# Altium schematic sheet S7CAS-PLEIADES-CARTE-MERE_Pxx_DDR.SchDoc
size Tabloid; SheetNumber: 4; SheetTotal: 17; Sheet_Name: DDR; Size: 11x17
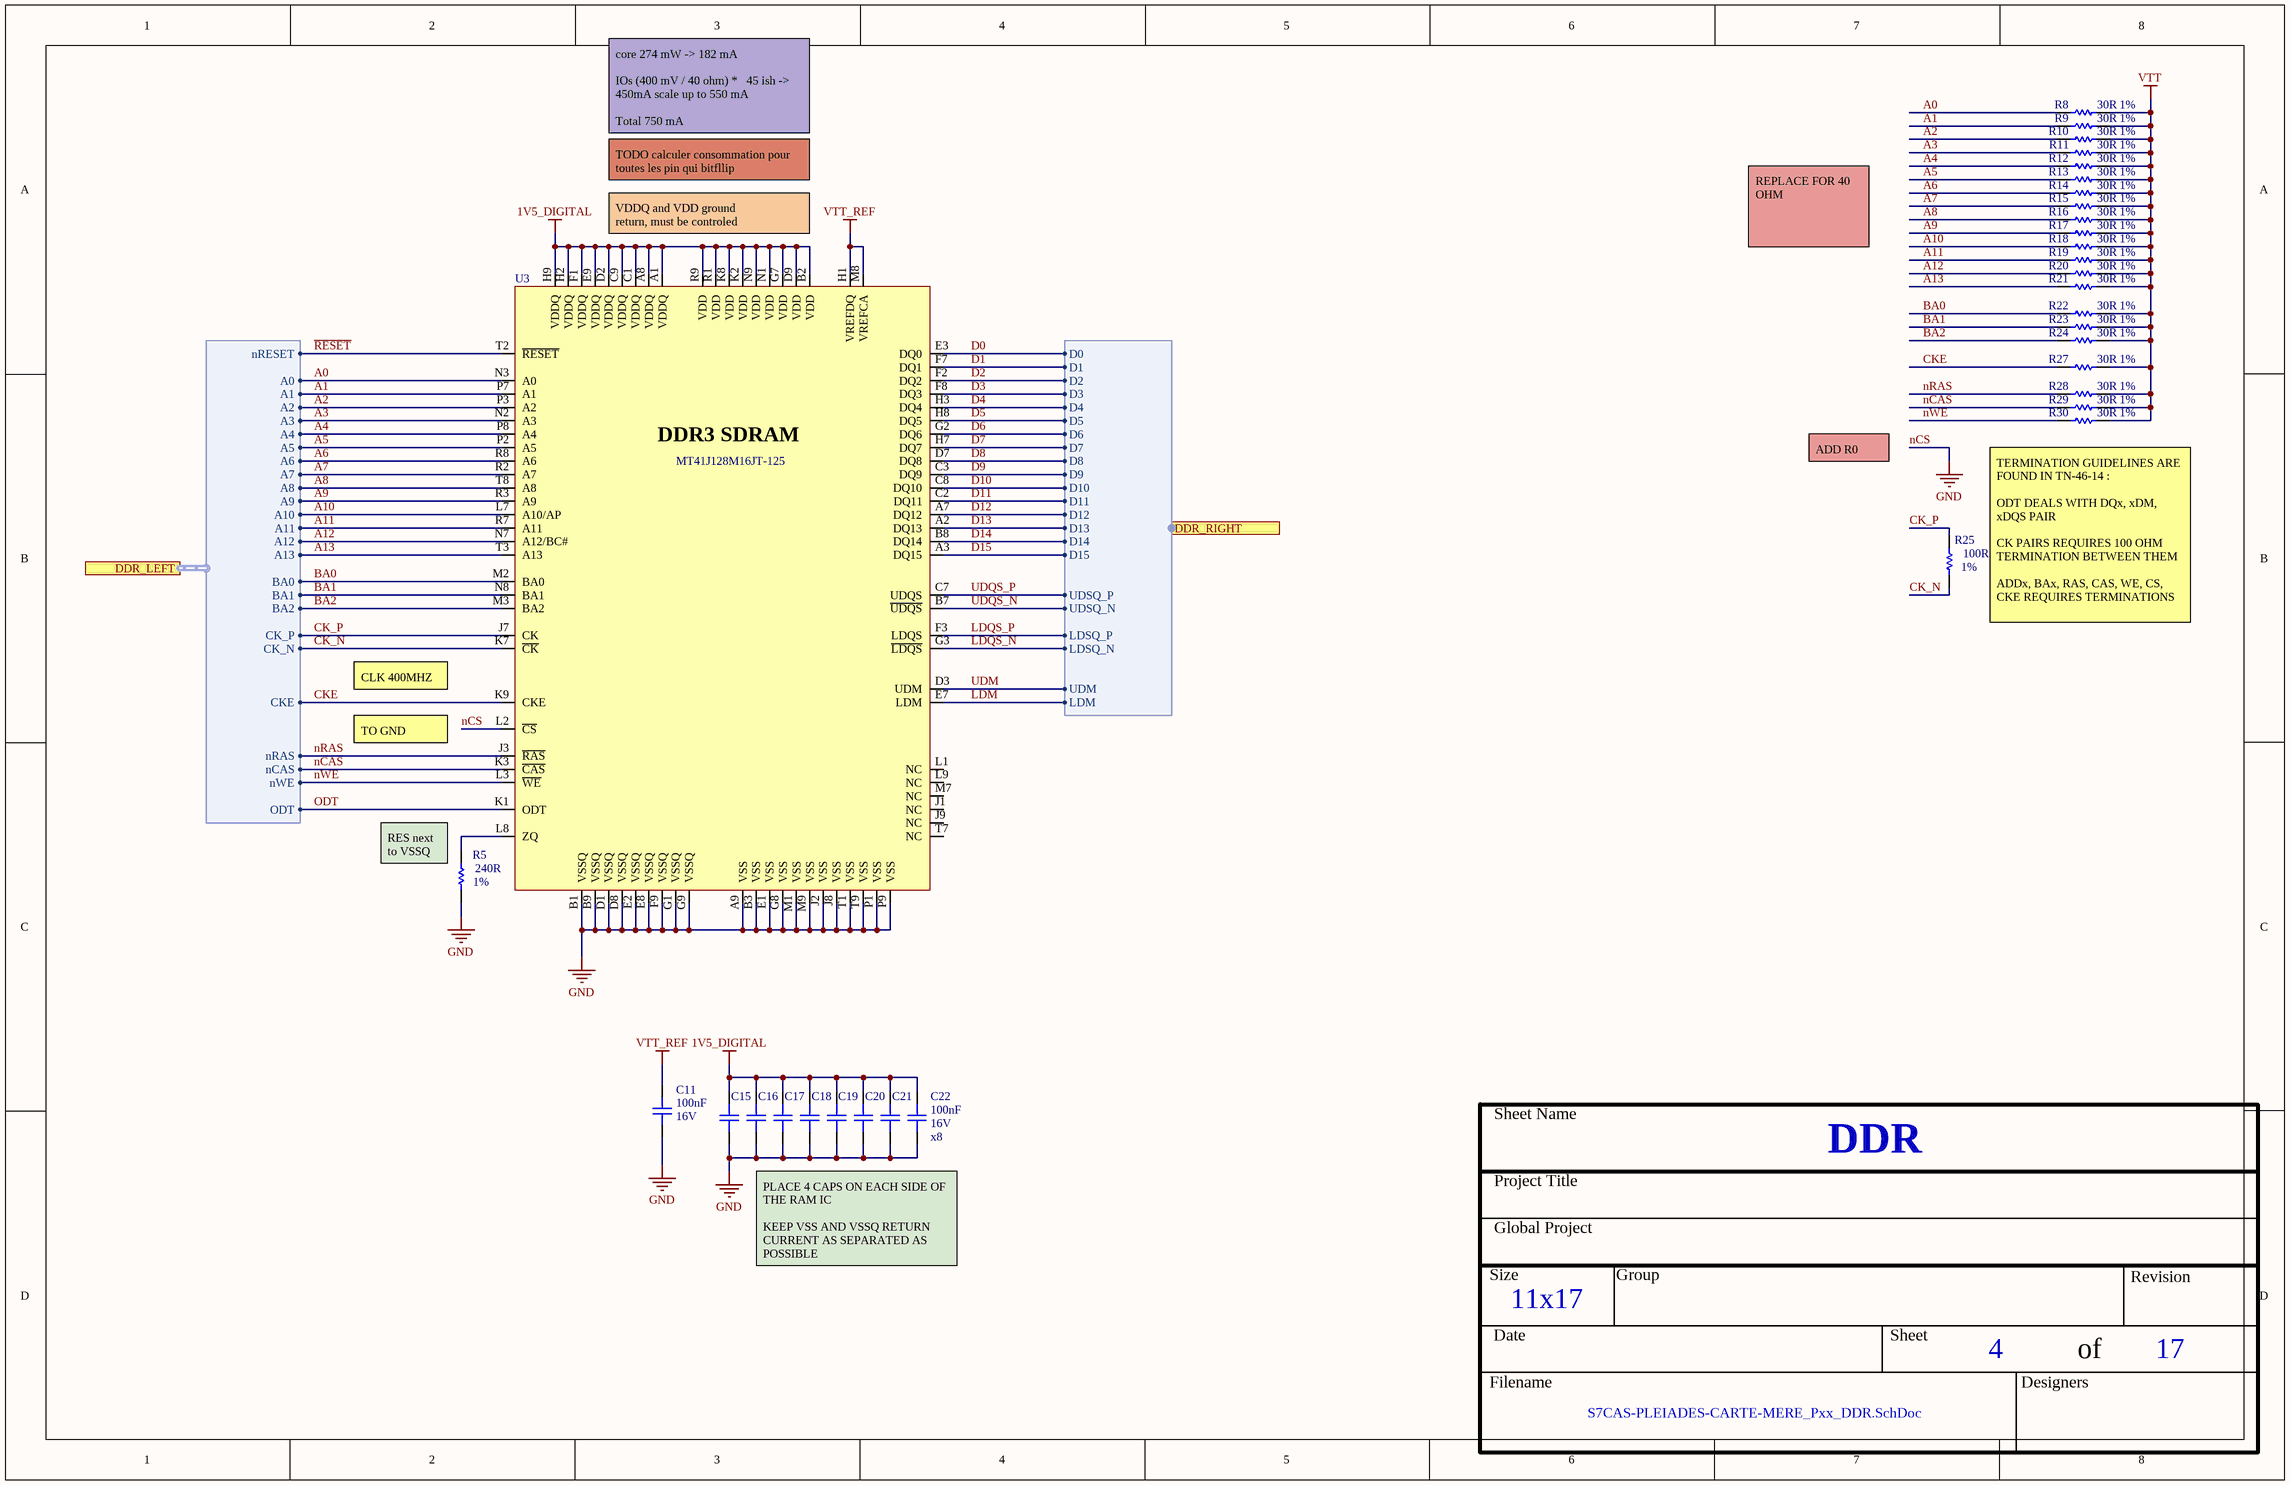
[diagram p0: S7CAS-PLEIADES-CARTE-MERE_Pxx_DDR.SchDoc]

## Parts
C11  value 100nF  Voltage: 16V  [CAP_0603]  (hidden comment: CAP - 0603)
C15  CAP - 0603  [CAP_0603]  (value not drawn)
C16  CAP - 0603  [CAP_0603]  (value not drawn)
C17  CAP - 0603  [CAP_0603]  (value not drawn)
C18  CAP - 0603  [CAP_0603]  (value not drawn)
C19  CAP - 0603  [CAP_0603]  (value not drawn)
C20  CAP - 0603  [CAP_0603]  (value not drawn)
C21  CAP - 0603  [CAP_0603]  (value not drawn)
C22  value 100nF  Voltage: 16V  [CAP_0603]  (hidden comment: CAP - 0603)
R5  value 240R  Precision: 1%  [RES_0603]  (hidden comment: RES - 0603)
R8  value 30R  Precision: 1%  [RES_0603]  (hidden comment: RES - 0603)
R9  value 30R  Precision: 1%  [RES_0603]  (hidden comment: RES - 0603)
R10  value 30R  Precision: 1%  [RES_0603]  (hidden comment: RES - 0603)
R11  value 30R  Precision: 1%  [RES_0603]  (hidden comment: RES - 0603)
R12  value 30R  Precision: 1%  [RES_0603]  (hidden comment: RES - 0603)
R13  value 30R  Precision: 1%  [RES_0603]  (hidden comment: RES - 0603)
R14  value 30R  Precision: 1%  [RES_0603]  (hidden comment: RES - 0603)
R15  value 30R  Precision: 1%  [RES_0603]  (hidden comment: RES - 0603)
R16  value 30R  Precision: 1%  [RES_0603]  (hidden comment: RES - 0603)
R17  value 30R  Precision: 1%  [RES_0603]  (hidden comment: RES - 0603)
R18  value 30R  Precision: 1%  [RES_0603]  (hidden comment: RES - 0603)
R19  value 30R  Precision: 1%  [RES_0603]  (hidden comment: RES - 0603)
R20  value 30R  Precision: 1%  [RES_0603]  (hidden comment: RES - 0603)
R21  value 30R  Precision: 1%  [RES_0603]  (hidden comment: RES - 0603)
R22  value 30R  Precision: 1%  [RES_0603]  (hidden comment: RES - 0603)
R23  value 30R  Precision: 1%  [RES_0603]  (hidden comment: RES - 0603)
R24  value 30R  Precision: 1%  [RES_0603]  (hidden comment: RES - 0603)
R25  value 100R  Precision: 1%  [RES_0603]  (hidden comment: RES - 0603)
R27  value 30R  Precision: 1%  [RES_0603]  (hidden comment: RES - 0603)
R28  value 30R  Precision: 1%  [RES_0603]  (hidden comment: RES - 0603)
R29  value 30R  Precision: 1%  [RES_0603]  (hidden comment: RES - 0603)
R30  value 30R  Precision: 1%  [RES_0603]  (hidden comment: RES - 0603)
U3  MT41J128M16JT-125  [MEM_DDR3_MT41J128M16JT-125]

## Ports
DDR_LEFT (harness ddr_left, see S7CAS-PLEIADES-CARTE-MERE_Pxx_FPGA_bank0_1_5[1C]), DDR_RIGHT (harness ddr_right, see S7CAS-PLEIADES-CARTE-MERE_Pxx_FPGA_bank0_1_5[3C])

## Harnesses
ddr_left: ODT, nRAS, nCAS, nWE, CKE, CK_P, CK_N, BA0, BA1, BA2, A0, A1, A2, A3, A4, A5, A6, A7, A8, A9, A10, A11, A12, A13, nRESET
ddr_right: D0, D1, D2, D3, D4, D5, D6, D7, D8, D9, D10, D11, D12, D13, D14, D15, UDSQ_P, UDSQ_N, LDSQ_N, LDSQ_P, UDM, LDM

## Nets
1V5_DIGITAL: C15.2 C16.2 C17.2 C18.2 C19.2 C20.2 C21.2 C22.2 U3.A1(VDDQ) U3.A8(VDDQ) U3.B2(VDD) U3.C1(VDDQ) U3.C9(VDDQ) U3.D2(VDDQ) U3.D9(VDD) U3.E9(VDDQ) U3.F1(VDDQ) U3.G7(VDD) U3.H2(VDDQ) U3.H9(VDDQ) U3.K2(VDD) U3.K8(VDD) U3.N1(VDD) U3.N9(VDD) U3.R1(VDD) U3.R9(VDD)
nCS: C11.1 C15.1 C16.1 C17.1 C18.1 C19.1 C20.1 C21.1 C22.1 R5.1 U3.A9(VSS) U3.B1(VSSQ) U3.B3(VSS) U3.B9(VSSQ) U3.D1(VSSQ) U3.D8(VSSQ) U3.E1(VSS) U3.E2(VSSQ) U3.E8(VSSQ) U3.F9(VSSQ) U3.G1(VSSQ) U3.G8(VSS) U3.G9(VSSQ) U3.J2(VSS) U3.J8(VSS) U3.L2(~{CS}) U3.M1(VSS) U3.M9(VSS) U3.P1(VSS) U3.P9(VSS) U3.T1(VSS) U3.T9(VSS)  [also labelled GND]
VTT: R8.1 R9.1 R10.1 R11.1 R12.1 R13.1 R14.1 R15.1 R16.1 R17.1 R18.1 R19.1 R20.1 R21.1 R22.1 R23.1 R24.1 R27.1 R28.1 R29.1 R30.1
VTT_REF: C11.2 U3.H1(VREFDQ) U3.M8(VREFCA)
~{RESET}: U3.T2(~{RESET}) ; port DDR_LEFT.nRESET
A0: R8.2 U3.N3(A0) ; port DDR_LEFT.A0
A1: R9.2 U3.P7(A1) ; port DDR_LEFT.A1
A2: R10.2 U3.P3(A2) ; port DDR_LEFT.A2
A3: R11.2 U3.N2(A3) ; port DDR_LEFT.A3
A4: R12.2 U3.P8(A4) ; port DDR_LEFT.A4
A5: R13.2 U3.P2(A5) ; port DDR_LEFT.A5
A6: R14.2 U3.R8(A6) ; port DDR_LEFT.A6
A7: R15.2 U3.R2(A7) ; port DDR_LEFT.A7
A8: R16.2 U3.T8(A8) ; port DDR_LEFT.A8
A9: R17.2 U3.R3(A9) ; port DDR_LEFT.A9
A10: R18.2 U3.L7(A10/AP) ; port DDR_LEFT.A10
A11: R19.2 U3.R7(A11) ; port DDR_LEFT.A11
A12: R20.2 U3.N7(A12/BC#) ; port DDR_LEFT.A12
A13: R21.2 U3.T3(A13) ; port DDR_LEFT.A13
BA0: R22.2 U3.M2(BA0) ; port DDR_LEFT.BA0
BA1: R23.2 U3.N8(BA1) ; port DDR_LEFT.BA1
BA2: R24.2 U3.M3(BA2) ; port DDR_LEFT.BA2
CK_N: R25.1 U3.K7(~{CK}) ; port DDR_LEFT.CK_N
CK_P: R25.2 U3.J7(CK) ; port DDR_LEFT.CK_P
CKE: R27.2 U3.K9(CKE) ; port DDR_LEFT.CKE
D0: U3.E3(DQ0) ; port DDR_RIGHT.D0
D1: U3.F7(DQ1) ; port DDR_RIGHT.D1
D2: U3.F2(DQ2) ; port DDR_RIGHT.D2
D3: U3.F8(DQ3) ; port DDR_RIGHT.D3
D4: U3.H3(DQ4) ; port DDR_RIGHT.D4
D5: U3.H8(DQ5) ; port DDR_RIGHT.D5
D6: U3.G2(DQ6) ; port DDR_RIGHT.D6
D7: U3.H7(DQ7) ; port DDR_RIGHT.D7
D8: U3.D7(DQ8) ; port DDR_RIGHT.D8
D9: U3.C3(DQ9) ; port DDR_RIGHT.D9
D10: U3.C8(DQ10) ; port DDR_RIGHT.D10
D11: U3.C2(DQ11) ; port DDR_RIGHT.D11
D12: U3.A7(DQ12) ; port DDR_RIGHT.D12
D13: U3.A2(DQ13) ; port DDR_RIGHT.D13
D14: U3.B8(DQ14) ; port DDR_RIGHT.D14
D15: U3.A3(DQ15) ; port DDR_RIGHT.D15
LDM: U3.E7(LDM) ; port DDR_RIGHT.LDM
LDQS_N: U3.G3(~{LDQS}) ; port DDR_RIGHT.LDSQ_N
LDQS_P: U3.F3(LDQS) ; port DDR_RIGHT.LDSQ_P
nCAS: R29.2 U3.K3(~{CAS}) ; port DDR_LEFT.nCAS
nRAS: R28.2 U3.J3(~{RAS}) ; port DDR_LEFT.nRAS
nWE: R30.2 U3.L3(~{WE}) ; port DDR_LEFT.nWE
ODT: U3.K1(ODT) ; port DDR_LEFT.ODT
UDM: U3.D3(UDM) ; port DDR_RIGHT.UDM
UDQS_N: U3.B7(~{UDQS}) ; port DDR_RIGHT.UDSQ_N
UDQS_P: U3.C7(UDQS) ; port DDR_RIGHT.UDSQ_P
NetR5_2: R5.2 U3.L8(ZQ)

Not connected (* = marked no-connect by the designer): U3 J1(NC) J9(NC) L1(NC) L9(NC) M7(NC) T7(NC)

## Notes on the sheet
- core 274 mW -> 182 mA
  IOs (400 mV / 40 ohm) *   45 ish -> 450mA scale up to 550 mA
  Total 750 mA
- VDDQ and VDD ground
  return, must be controled
- TODO calculer consommation pour toutes les pin qui bitfllip
- REPLACE FOR 40 OHM
- ADD R0
- TERMINATION GUIDELINES ARE FOUND IN TN-46-14 :
  ODT DEALS WITH DQx, xDM, xDQS PAIR
  CK PAIRS REQUIRES 100 OHM TERMINATION BETWEEN THEM
  ADDx, BAx, RAS, CAS, WE, CS, CKE REQUIRES TERMINATIONS
- CLK 400MHZ
- TO GND
- (near R5) RES next to VSSQ
- (near C22) x8
- PLACE 4 CAPS ON EACH SIDE OF THE RAM IC
  KEEP VSS AND VSSQ RETURN CURRENT AS SEPARATED AS POSSIBLE
- Sheet Name
- Project Title
- Global Project
- Size
- Group
- Revision
- Date
- Sheet
- of
- Filename
- Designers
- (in symbol MEM_DDR3_MT41J128M16JT-125:K TR) DDR3 SDRAM

## Library data of the parts
C11 C22 = CAP - 0603: Precision: 10%; Current: *; CreatedBy: Jonathan Bouchard; Power: *; Package: 0603; Supplier 1: Arrow Electronics; Supplier Part Number 1: CL10B104KO8NNNC
C15-C21 = CAP - 0603: Precision: 10%; Voltage: 16V; Value: 100nF; Current: *; CreatedBy: Jonathan Bouchard; Power: *; Package: 0603; Supplier 1: Arrow Electronics; Supplier Part Number 1: CL10B104KO8NNNC
U3 = MEM_DDR3_MT41J128M16JT-125:K TR: MEM - DDR3 SDRAM 2GBIT 800MHZ - TFBGA-96; Voltage: 1.425 V ~ 1.575 V; Mfg: Micrel; Current: *; Power: *; Mfg Part Number: MT41J128M16JT-125; HelpURL: http://www.micron.com/~/media/Documents/Products/Data%20Sheet/DRAM/DDR3/2Gb_DDR3_SDRAM.pdf; CreatedBy: Jonathan Bouchard; Temperature: 0°C ~ 95°C (TC); Value: *; Precision: *; Package: TFBGA-96; Supplier 1: Digikey; Supplier Part Number 1: 557-1611-1-ND
R5 R8-R25 R27-R30 = RES - 0603: Current: *; CreatedBy: Jonathan Bouchard; Package: 0603; Supplier 1: Arrow Electronics
  R5: Supplier Part Number 1: RMCF0603FT240R
  R8-R24 R27-R30: Supplier Part Number 1: RMCF0603FT30R0
  R25: Supplier Part Number 1: RMCF0603FT100R